# EAGLE design untitled (EAGLE 9.0.1)
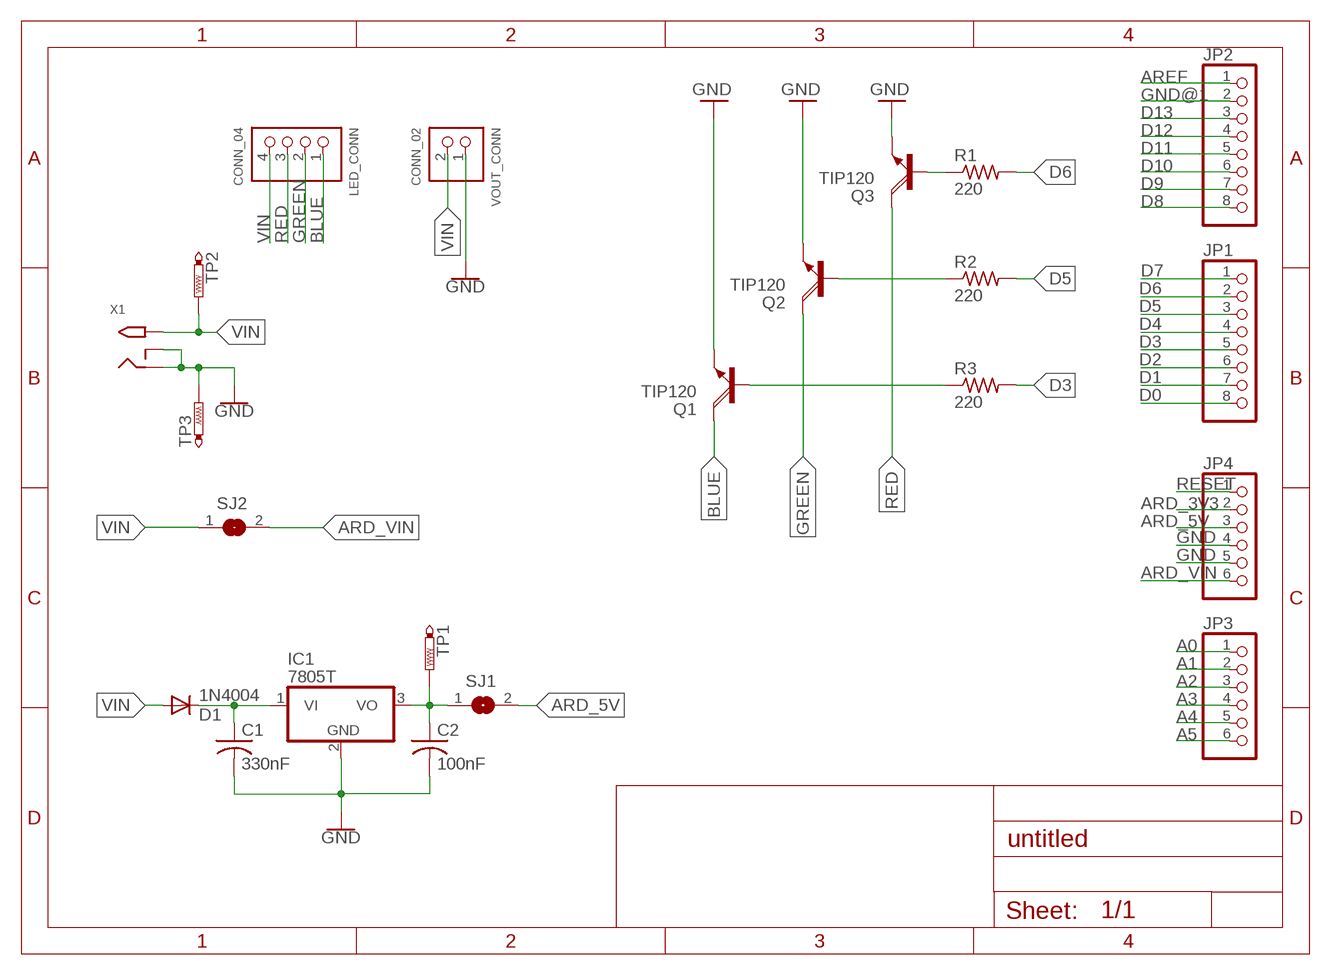
[diagram p0: schematic, sheet 1]

## Parts
C1  330nF  C-US050-035X075  [C050-035X075]
C2  100nF  C-US050-035X075  [C050-035X075]
D1  1N4004  [DO41-10]
IC1  7805T  [TO220H]
JP1  PINHD-1X8  [1X08]
JP2  PINHD-1X8  [1X08]
JP3  PINHD-1X6  [1X06]
JP4  PINHD-1X6  [1X06]
LED_CONN  CONN_04  [SCREWTERMINAL-5MM-4]
Q1  TIP120  [TO220AH]
Q2  TIP120  [TO220AH]
Q3  TIP120  [TO220AH]
R1  220  R-US_0207/9  [0207/9]
R2  220  R-US_0207/9  [0207/9]
R3  220  R-US_0207/9  [0207/9]
SJ1  SJ  [SJ]
SJ2  SJ  [SJ]
TP1  PTR1B1,27  [B1,27]
TP2  PTR1B1,27  [B1,27]
TP3  PTR1B1,27  [B1,27]
VOUT_CONN  CONN_02  [SCREWTERMINAL-5MM-2]
X1  2.1MMJACKTHM  [PJ-102A]

## Nets
A0: JP3.1
A1: JP3.2
A2: JP3.3
A3: JP3.4
A4: JP3.5
A5: JP3.6
ARD_3V3: JP4.2
ARD_5V: JP4.3 SJ1.2
ARD_VIN: JP4.6 SJ2.2
AREF: JP2.1
BLUE: LED_CONN.1 Q1.C
D0: JP1.8
D1: JP1.7
D2: JP1.6
D3: JP1.5 R3.2
D4: JP1.4
D5: JP1.3 R2.2
D6: JP1.2 R1.2
D7: JP1.1
D8: JP2.8
D9: JP2.7
D10: JP2.6
D11: JP2.5
D12: JP2.4
D13: JP2.3
GND: C1.2 C2.2 IC1.2(GND) JP4.4 JP4.5 Q1.E Q2.E Q3.E TP3.TP VOUT_CONN.1 X1.RING X1.RING_SW
GND@1: JP2.2
GREEN: LED_CONN.2 Q2.C
N$1: C1.1 D1.C IC1.1(VI)
N$7: Q3.B R1.1
N$8: Q2.B R2.1
N$9: Q1.B R3.1
RED: LED_CONN.3 Q3.C
REG_5V: C2.1 IC1.3(VO) SJ1.1 TP1.TP
RESET: JP4.1
VIN: D1.A LED_CONN.4 SJ2.1 TP2.TP VOUT_CONN.2 X1.TIP

## Library data of the parts
C1 C2 = adafruit:C-US: CAPACITOR, American symbol
D1 = adafruit:1N4004: DIODE General purpose 1N400x type rectifier (With bigger pads) http://www.ladyada.net/library/pcb/eaglelibrary.html
IC1 = adafruit:78*: Positive VOLTAGE REGULATOR Added bigger pads to the TO-92 package
JP1 JP2 = pinhead:PINHD-1X8: PIN HEADER
JP3 JP4 = pinhead:PINHD-1X6: PIN HEADER
LED_CONN = Pamir:CONN_04
Q1-Q3 = Pamir:TIP120: NPN DARLINGTON TRANSISTOR
R1-R3 = adafruit:R-US_: RESISTOR, American symbol
SJ1 SJ2 = jumper:SJ: SMD solder JUMPER
TP1-TP3 = testpad:PTR1: TEST PIN
VOUT_CONN = Pamir:CONN_02
X1 = adafruit:2.1MMJACK: 2.1mm x 5.5mm THM DC jack with internal switch. Digikey part #PJ-102A, 4UCON part #05537 2.1mm x 5.5mm SMT DC jack with internal switch. Digikey part #PJ-002A-SMT, 4UCON part #03267 By microbuilder.eu & adafruit.com

## Board
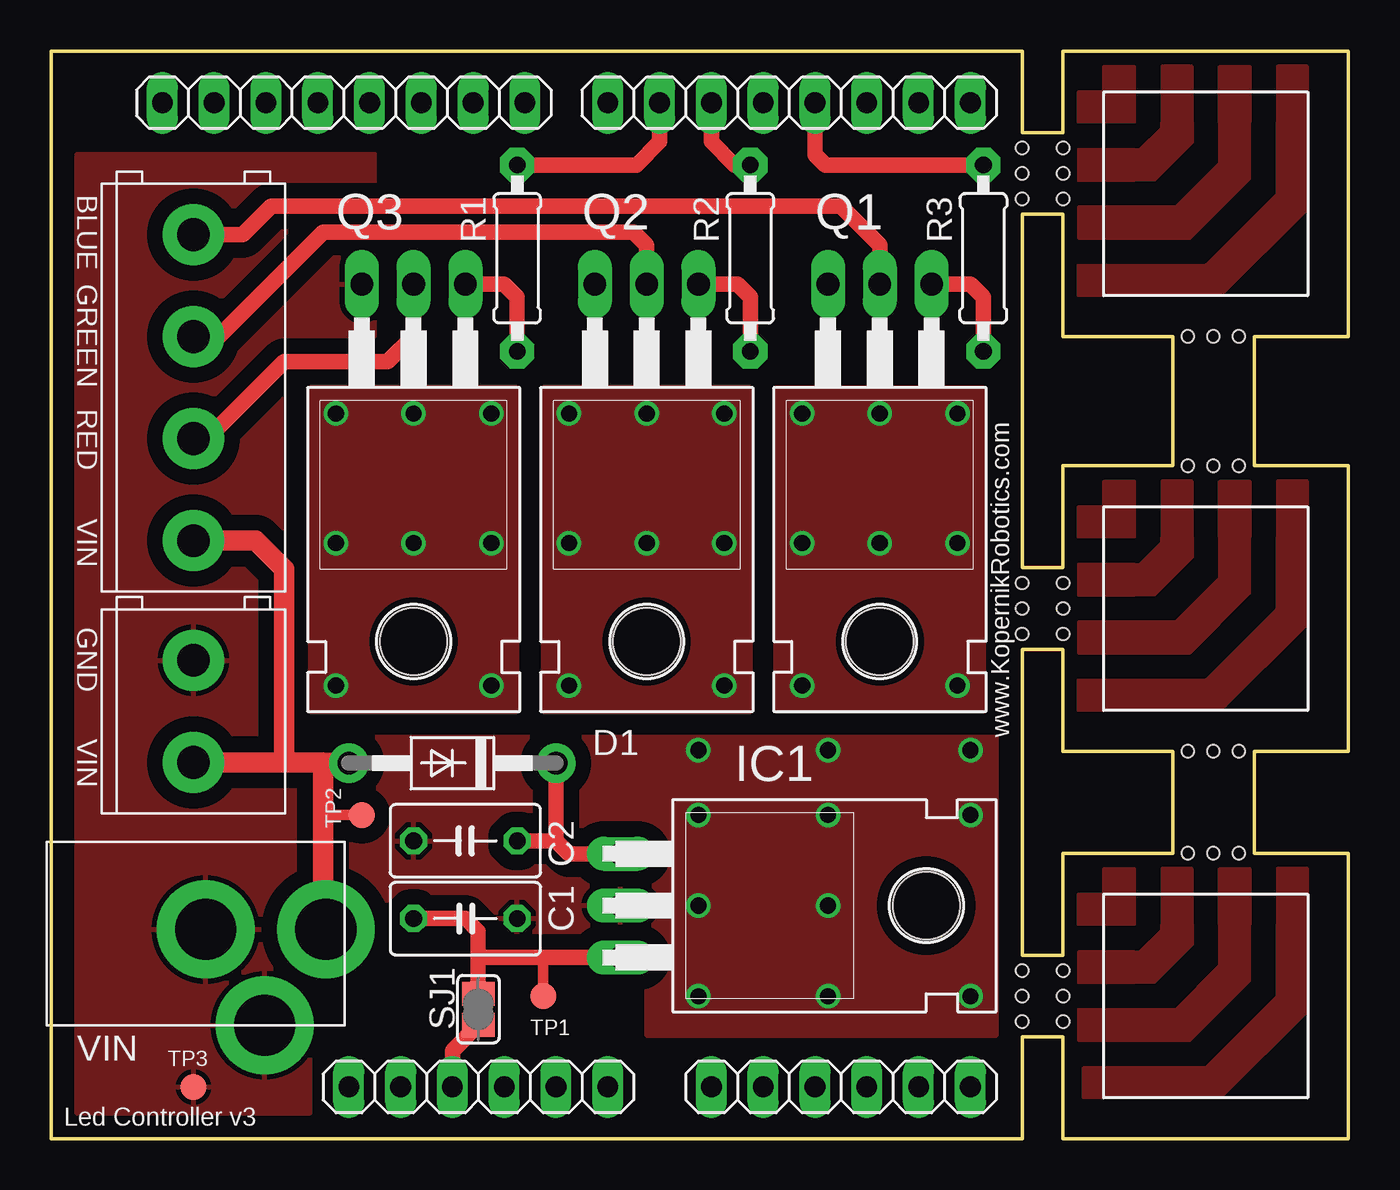
[diagram p1: board, top side]
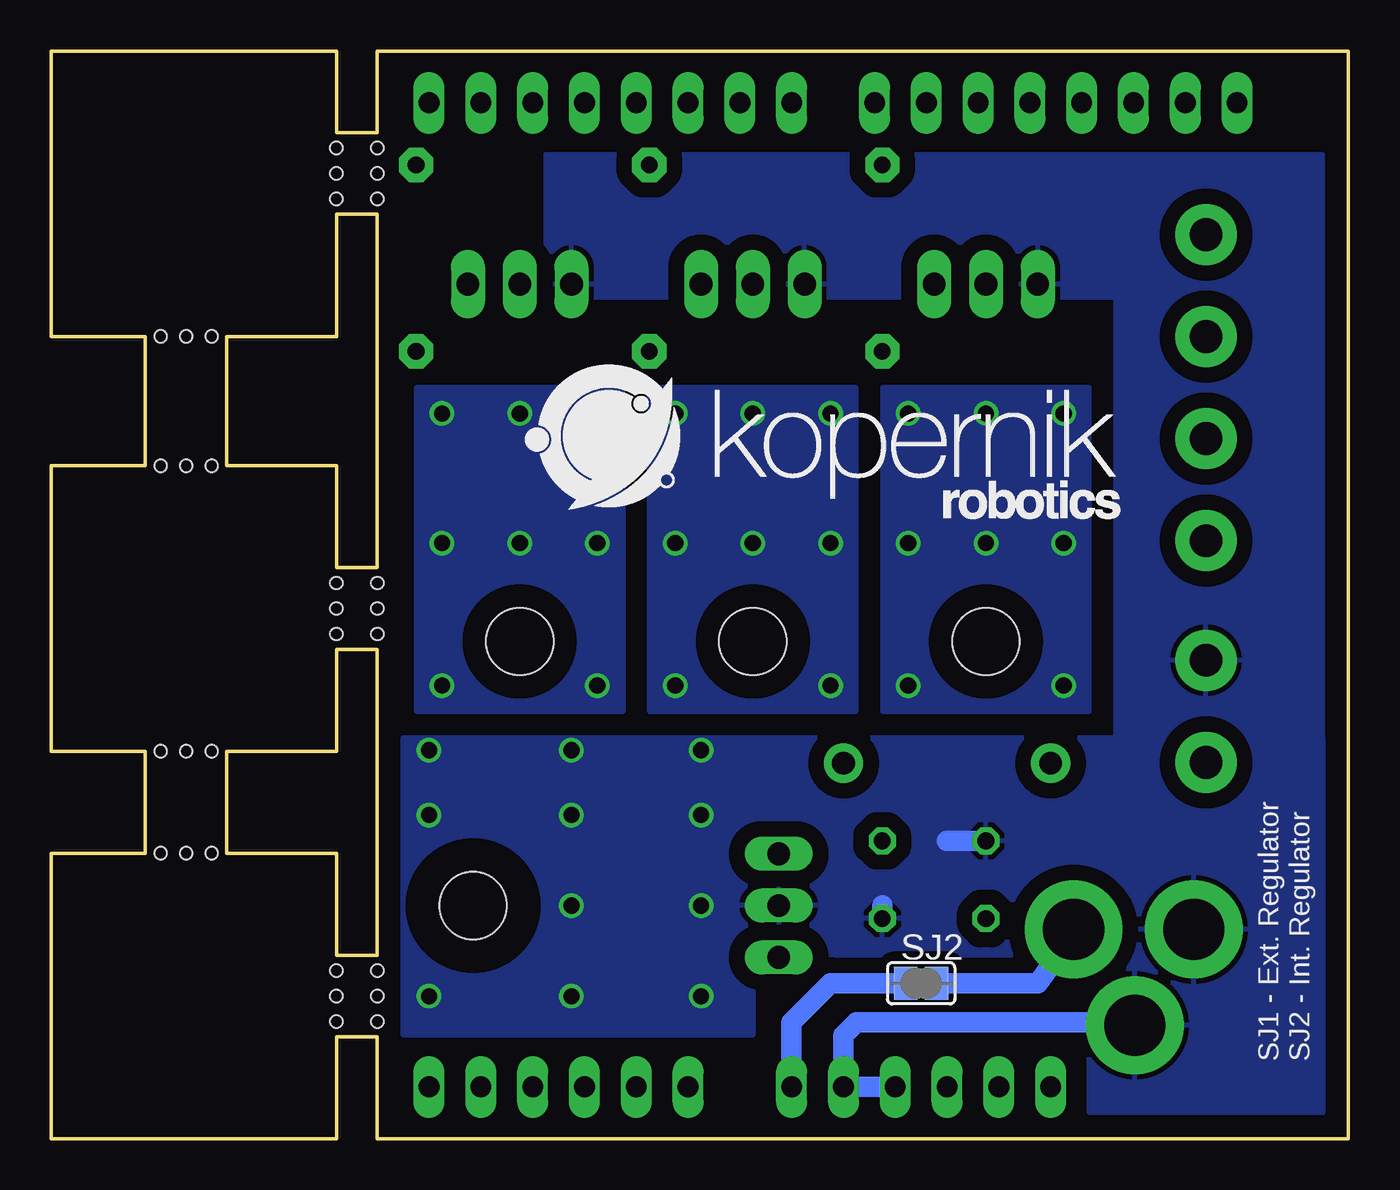
[diagram p2: board, bottom side, seen from below]

Size 63.62 x 53.34 mm. Coordinates in mm from the lower left corner, seen from the top.
Outline: 0,0 0,53.34 47.62,53.34 47.62,49.34 49.62,49.34 49.62,53.34 63.62,53.34 63.62,39.34 59,39.34 59,33 63.62,33 63.62,19 59,19 59,14 63.62,14 63.62,0 49.62,0 49.62,5 47.62,5 47.62,0 0,0
Outline: 49.62,9 49.62,14 55,14 55,19 49.62,19 49.62,24 47.62,24 47.62,9 49.62,9
Outline: 49.62,28 49.62,33 55,33 55,39.34 49.62,39.34 49.62,45.34 47.62,45.34 47.62,28 49.62,28
Copper layers (1*16): Top 0.035mm / dielectric 1.5mm / Bottom 0.035mm
Design rules "SeeedStudio_2layer_DRU_no_angle_20140221": minimum track width 6mil, minimum drill 12mil, track to track 6mil, track to pad 6mil, pad to pad 6mil, via to via 6mil, smd to smd 0mil, copper to edge 10mil, drill to drill 10mil, minimum pad ring 10mil, minimum via ring 6mil, stop-mask expansion 2mil, vias tented up to drill 100mil, thermal gap 10mil
Holes 0.6 mm at 47.62,8.25 47.62,5.75 49.62,8.25 49.62,5.75 47.62,7 49.62,7 55.75,14 57,14 58.25,14 57,19 55.75,19 58.25,19 47.62,26 47.62,27.25 47.62,24.75 49.62,24.75 49.62,26 49.62,27.25 57,33 55.75,33 58.25,33 57,39.34 55.75,39.34 58.25,39.34 47.62,47.34 47.62,48.59 47.62,46.09 49.62,46.09 49.62,47.34 49.62,48.59
Milling: 36 lines

### Footprints (pad centres in the part's own frame; a part is rotated, then mirrored left to right if it is on the bottom)
C050-035X075 = drill 0.813 octagon: 1 -2.54,0; 2 2.54,0
DO41-10 = drill 1.118 pad 1.93: A 5.08,0; C -5.08,0
TO220H = drill 1.118 long: 1 -2.54,-10.16; 2 0,-10.16; 3 2.54,-10.16 | hole 3.302: 0,4.826
1X08 = drill 1.016 long: 1 -8.89,0; 2 -6.35,0; 3 -3.81,0; 4 -1.27,0; 5 1.27,0; 6 3.81,0; 7 6.35,0; 8 8.89,0
1X06 = drill 1.016 long: 1 -6.35,0; 2 -3.81,0; 3 -1.27,0; 4 1.27,0; 5 3.81,0; 6 6.35,0
SCREWTERMINAL-5MM-4 = drill 1.6 pad 3: 1 -7.5,0; 2 -2.5,0; 3 2.5,0; 4 7.5,0
TO220AH = drill 1.118 long: B -2.54,-6.35; C 0,-6.35; E 2.54,-6.35 | hole 3.302: 0,11.176
0207/9 = drill 0.813 pad 1.676 octagon: 1 -4.572,0; 2 4.572,0
SJ = smd 1.168 x 1.6: 1 -0.762,0; 2 0.762,0
B1,27 = smd 1.27 x 1.27: TP 0,0
SCREWTERMINAL-5MM-2 = drill 1.6 pad 3: 1 -2.5,0; 2 2.5,0
PJ-102A = drill 3 pad 4.8: RING 0.1,-3.39; RING_SW -4.6,-6.29; TIP 0.1,-9.29

### Placement (x,y rotation side)
C1  20.32,14.61 180 top
C2  20.32,10.79 0 top
D1  19.68,18.41 180 top
IC1  38.1,11.43 270 top
JP1  36.2,50.8 0 top
JP2  14.35,50.8 0 top
JP3  38.73,2.54 0 top
JP4  20.95,2.54 0 top
LED_CONN  6.99,36.83 270 top
Q1  40.64,35.56 180 top
Q2  29.21,35.56 180 top
Q3  17.78,35.56 180 top
R1  22.86,43.18 90 top
R2  34.29,43.18 90 top
R3  45.72,43.18 90 top
SJ1  20.95,6.35 270 top
SJ2  20.95,7.62 180 bottom
TP1  24.13,6.99 0 top
TP2  15.24,15.88 0 top
TP3  6.99,2.54 0 top
VOUT_CONN  6.99,20.95 270 top
X1  4.19,10.16 90 top

### Tracks (layer width: path | path; a pad name or v marks a point on that pad's centre or on a via)
ARD_5V
  Top 0.762: SJ1.2 19.68,4.32 JP4.3
ARD_VIN
  Bottom 1.016: JP4.6 27.3,5.71 25.4,7.62 SJ2.2
BLUE
  Top 0.762: Q1.C 40.64,43.81 38.73,45.72 10.79,45.72 9.4,44.33 LED_CONN.1
D3
  Top 0.762: JP1.5 37.47,48.26 37.97,47.75 R3.2
D5
  Top 0.762: JP1.3 32.38,48.9 33.53,47.75 R2.2
D6
  Top 0.762: JP1.2 29.84,48.9 28.7,47.75 R1.2
GND  (via drill 0.8)
  Bottom 1.016: C1.2 19.68,14.61 | C2.2 22.86,11.43 | JP4.4 JP4.5 24.77,5.08 24.13,5.71 10.64,5.71 X1.RING_SW
  other vias: 45.09,15.88 45.09,6.99 31.75,6.99 31.75,15.88 38.1,15.88 38.1,6.99 31.75,11.43 38.1,11.43 31.75,19.05 38.1,19.05 45.09,19.05
  pour Bottom (isolate 0.762): 1.27,1.27 12.7,1.27 12.7,7.62 29.21,7.62 29.21,5.08 46.35,5.08 46.35,19.68 1.27,19.68
  pour Bottom (isolate 0.762): 1.27,19.68 1.27,48.26 39.37,48.26 39.37,41.27 11.43,41.27 11.43,19.68
  pour Top (isolate 0.762): 1.27,1.27 12.7,1.27 12.7,9.53 29.21,9.53 29.21,5.08 46.35,5.08 46.35,19.68 1.27,19.68
  pour Top (isolate 0.762): 1.27,19.68 11.43,19.68 11.43,39.37 15.88,39.37 15.88,48.26 1.27,48.26
GREEN
  Top 0.762: LED_CONN.2 8.21,39.33 13.34,44.45 28.57,44.45 29.21,43.81 Q2.C
N$1
  Top 0.762: 24.77,14.61 D1.C | C1.1 24.77,14.61 | 24.77,14.61 25.4,13.97 IC1.1
N$7
  Top 0.762: R1.1 22.86,41.27 22.23,41.91 Q3.B
N$8
  Top 0.762: R2.1 34.29,41.27 33.66,41.91 Q2.B
N$9
  Top 0.762: R3.1 45.72,41.27 45.09,41.91 Q1.B
Q1_PAD  (via drill 0.8)
  other vias: 36.83,35.56 40.64,35.56 44.45,35.56 36.83,22.23 44.45,22.23 44.45,29.21 40.64,29.21 36.83,29.21
  pour Top (isolate 0.508): 35.56,36.83 45.72,36.83 45.72,20.95 35.56,20.95
  pour Bottom (isolate 0.508): 35.56,36.83 45.72,36.83 45.72,20.95 35.56,20.95
Q2_PAD  (via drill 0.8)
  other vias: 25.4,35.56 29.21,35.56 33.02,35.56 33.02,22.23 25.4,22.23 25.4,29.21 29.21,29.21 33.02,29.21
  pour Top (isolate 0.508): 24.13,20.95 34.29,20.95 34.29,36.83 24.13,36.83
  pour Bottom (isolate 0.508): 24.13,36.83 34.29,36.83 34.29,20.95 24.13,20.95
Q3_PAD  (via drill 0.8)
  other vias: 13.97,22.23 21.59,22.23 13.97,35.56 21.59,35.56 13.97,29.21 17.78,29.21 21.59,29.21 17.78,35.56
  pour Top (isolate 0.508): 12.7,20.95 22.86,20.95 22.86,36.83 12.7,36.83
  pour Bottom (isolate 0.508): 12.7,36.83 22.86,36.83 22.86,20.95 12.7,20.95
RED
  Top 0.762: Q3.C 17.78,39.37 16.51,38.1 11.43,38.1 7.66,34.33 LED_CONN.3
REG_5V
  Top 0.508: TP1.TP 24.13,8.89
  Top 0.762: IC1.3 24.13,8.89 20.95,8.89 | C2.1 20.32,10.79 20.95,10.16 20.95,8.89 | SJ1.1 20.95,8.89
S$1
  pour Top: 50.62,3.5 53.12,3.5 53.12,2 50.62,2
  pour Top: 53.12,3.5 56.62,3.5 60.12,7 60.12,10.5 61.62,10.5 61.62,6.25 57.38,2 53.12,2
  pour Top: 61.62,13.25 60.12,13.25 60.12,10.5 61.62,10.5
S$2
  pour Top: 58.8,13.25 58.8,10.5 57.3,10.5 57.3,13.25
  pour Top: 53.12,4.83 55.88,4.83 58.8,7.75 58.8,10.5 57.3,10.5 57.3,8.5 55.12,6.33 53.12,6.33
  pour Top: 50.38,4.83 53.12,4.83 53.12,6.33 50.38,6.33
S$3
  pour Top: 50.38,7.66 53.12,7.66 53.12,9.16 50.38,9.16
  pour Top: 53.38,9.16 54.47,10.25 55.97,10.25 55.97,9.5 54.12,7.66 53.38,7.66
  pour Top: 54.47,13.25 54.47,10.5 55.97,10.5 55.97,13.25
  pour Top: 53.12,9.16 53.38,9.16 53.38,7.66 53.12,7.66
  pour Top: 54.47,10.5 55.97,10.5 55.97,10.25 54.47,10.25
S$4
  pour Top: 50.38,12 53.12,12 53.12,10.5 50.38,10.5
  pour Top: 51.62,12 51.62,13.25 53.12,13.25 53.12,12
S$5
  pour Top: 50.38,42.84 53.12,42.84 53.12,41.34 50.38,41.34
  pour Top: 53.12,42.84 56.62,42.84 60.12,46.34 60.12,49.84 61.62,49.84 61.62,45.59 57.38,41.34 53.12,41.34
  pour Top: 61.62,52.59 60.12,52.59 60.12,49.84 61.62,49.84
S$6
  pour Top: 58.8,52.59 58.8,49.84 57.3,49.84 57.3,52.59
  pour Top: 53.12,44.17 55.88,44.17 58.8,47.09 58.8,49.84 57.3,49.84 57.3,47.84 55.12,45.67 53.12,45.67
  pour Top: 50.38,44.17 53.12,44.17 53.12,45.67 50.38,45.67
S$7
  pour Top: 50.38,47 53.12,47 53.12,48.5 50.38,48.5
  pour Top: 53.38,48.5 54.47,49.59 55.97,49.59 55.97,48.84 54.12,47 53.38,47
  pour Top: 54.47,52.59 54.47,49.84 55.97,49.84 55.97,52.59
  pour Top: 53.12,48.5 53.38,48.5 53.38,47 53.12,47
  pour Top: 54.47,49.84 55.97,49.84 55.97,49.59 54.47,49.59
S$8
  pour Top: 50.38,51.34 53.12,51.34 53.12,49.84 50.38,49.84
  pour Top: 51.62,51.34 51.62,52.59 53.12,52.59 53.12,51.34
S$9
  pour Top: 50.38,22.5 53.12,22.5 53.12,21 50.38,21
  pour Top: 53.12,22.5 56.62,22.5 60.12,26 60.12,29.5 61.62,29.5 61.62,25.25 57.38,21 53.12,21
  pour Top: 61.62,32.25 60.12,32.25 60.12,29.5 61.62,29.5
S$10
  pour Top: 58.8,32.25 58.8,29.5 57.3,29.5 57.3,32.25
  pour Top: 53.12,23.83 55.88,23.83 58.8,26.75 58.8,29.5 57.3,29.5 57.3,27.5 55.12,25.33 53.12,25.33
  pour Top: 50.38,23.83 53.12,23.83 53.12,25.33 50.38,25.33
S$11
  pour Top: 50.38,26.66 53.12,26.66 53.12,28.16 50.38,28.16
  pour Top: 53.38,28.16 54.47,29.25 55.97,29.25 55.97,28.5 54.12,26.66 53.38,26.66
  pour Top: 54.47,32.25 54.47,29.5 55.97,29.5 55.97,32.25
  pour Top: 53.12,28.16 53.38,28.16 53.38,26.66 53.12,26.66
  pour Top: 54.47,29.5 55.97,29.5 55.97,29.25 54.47,29.25
S$12
  pour Top: 50.38,31 53.12,31 53.12,29.5 50.38,29.5
  pour Top: 51.62,31 51.62,32.25 53.12,32.25 53.12,31
VIN
  Top 0.508: TP2.TP 13.34,15.88
  Top 1.016: X1.TIP 13.34,10.41 13.34,15.88 13.34,18.41 | 13.34,18.41 D1.A | 13.34,18.41 13.29,18.45 11.43,18.45 | 11.43,18.45 VOUT_CONN.2 | LED_CONN.4 10.04,29.33 11.43,27.94 11.43,18.45
  Bottom 1.016: SJ2.1 15.24,7.62 13.48,10.01 X1.TIP

### Text on the board
tNames: BLUE | GREEN | RED | VIN | GND | www.KopernikRobotics.com | VIN | VIN | Led Controller v3
bNames: SJ1 - Ext. Regulator / SJ2 - Int. Regulator